# Altium schematic sheet MCU.SchDoc: MCU
size 420 x 297 mm; DrawnBy: Hung Vo; SheetNumber: 1; SheetTotal: 4; MasterProject: BTL TKHTN
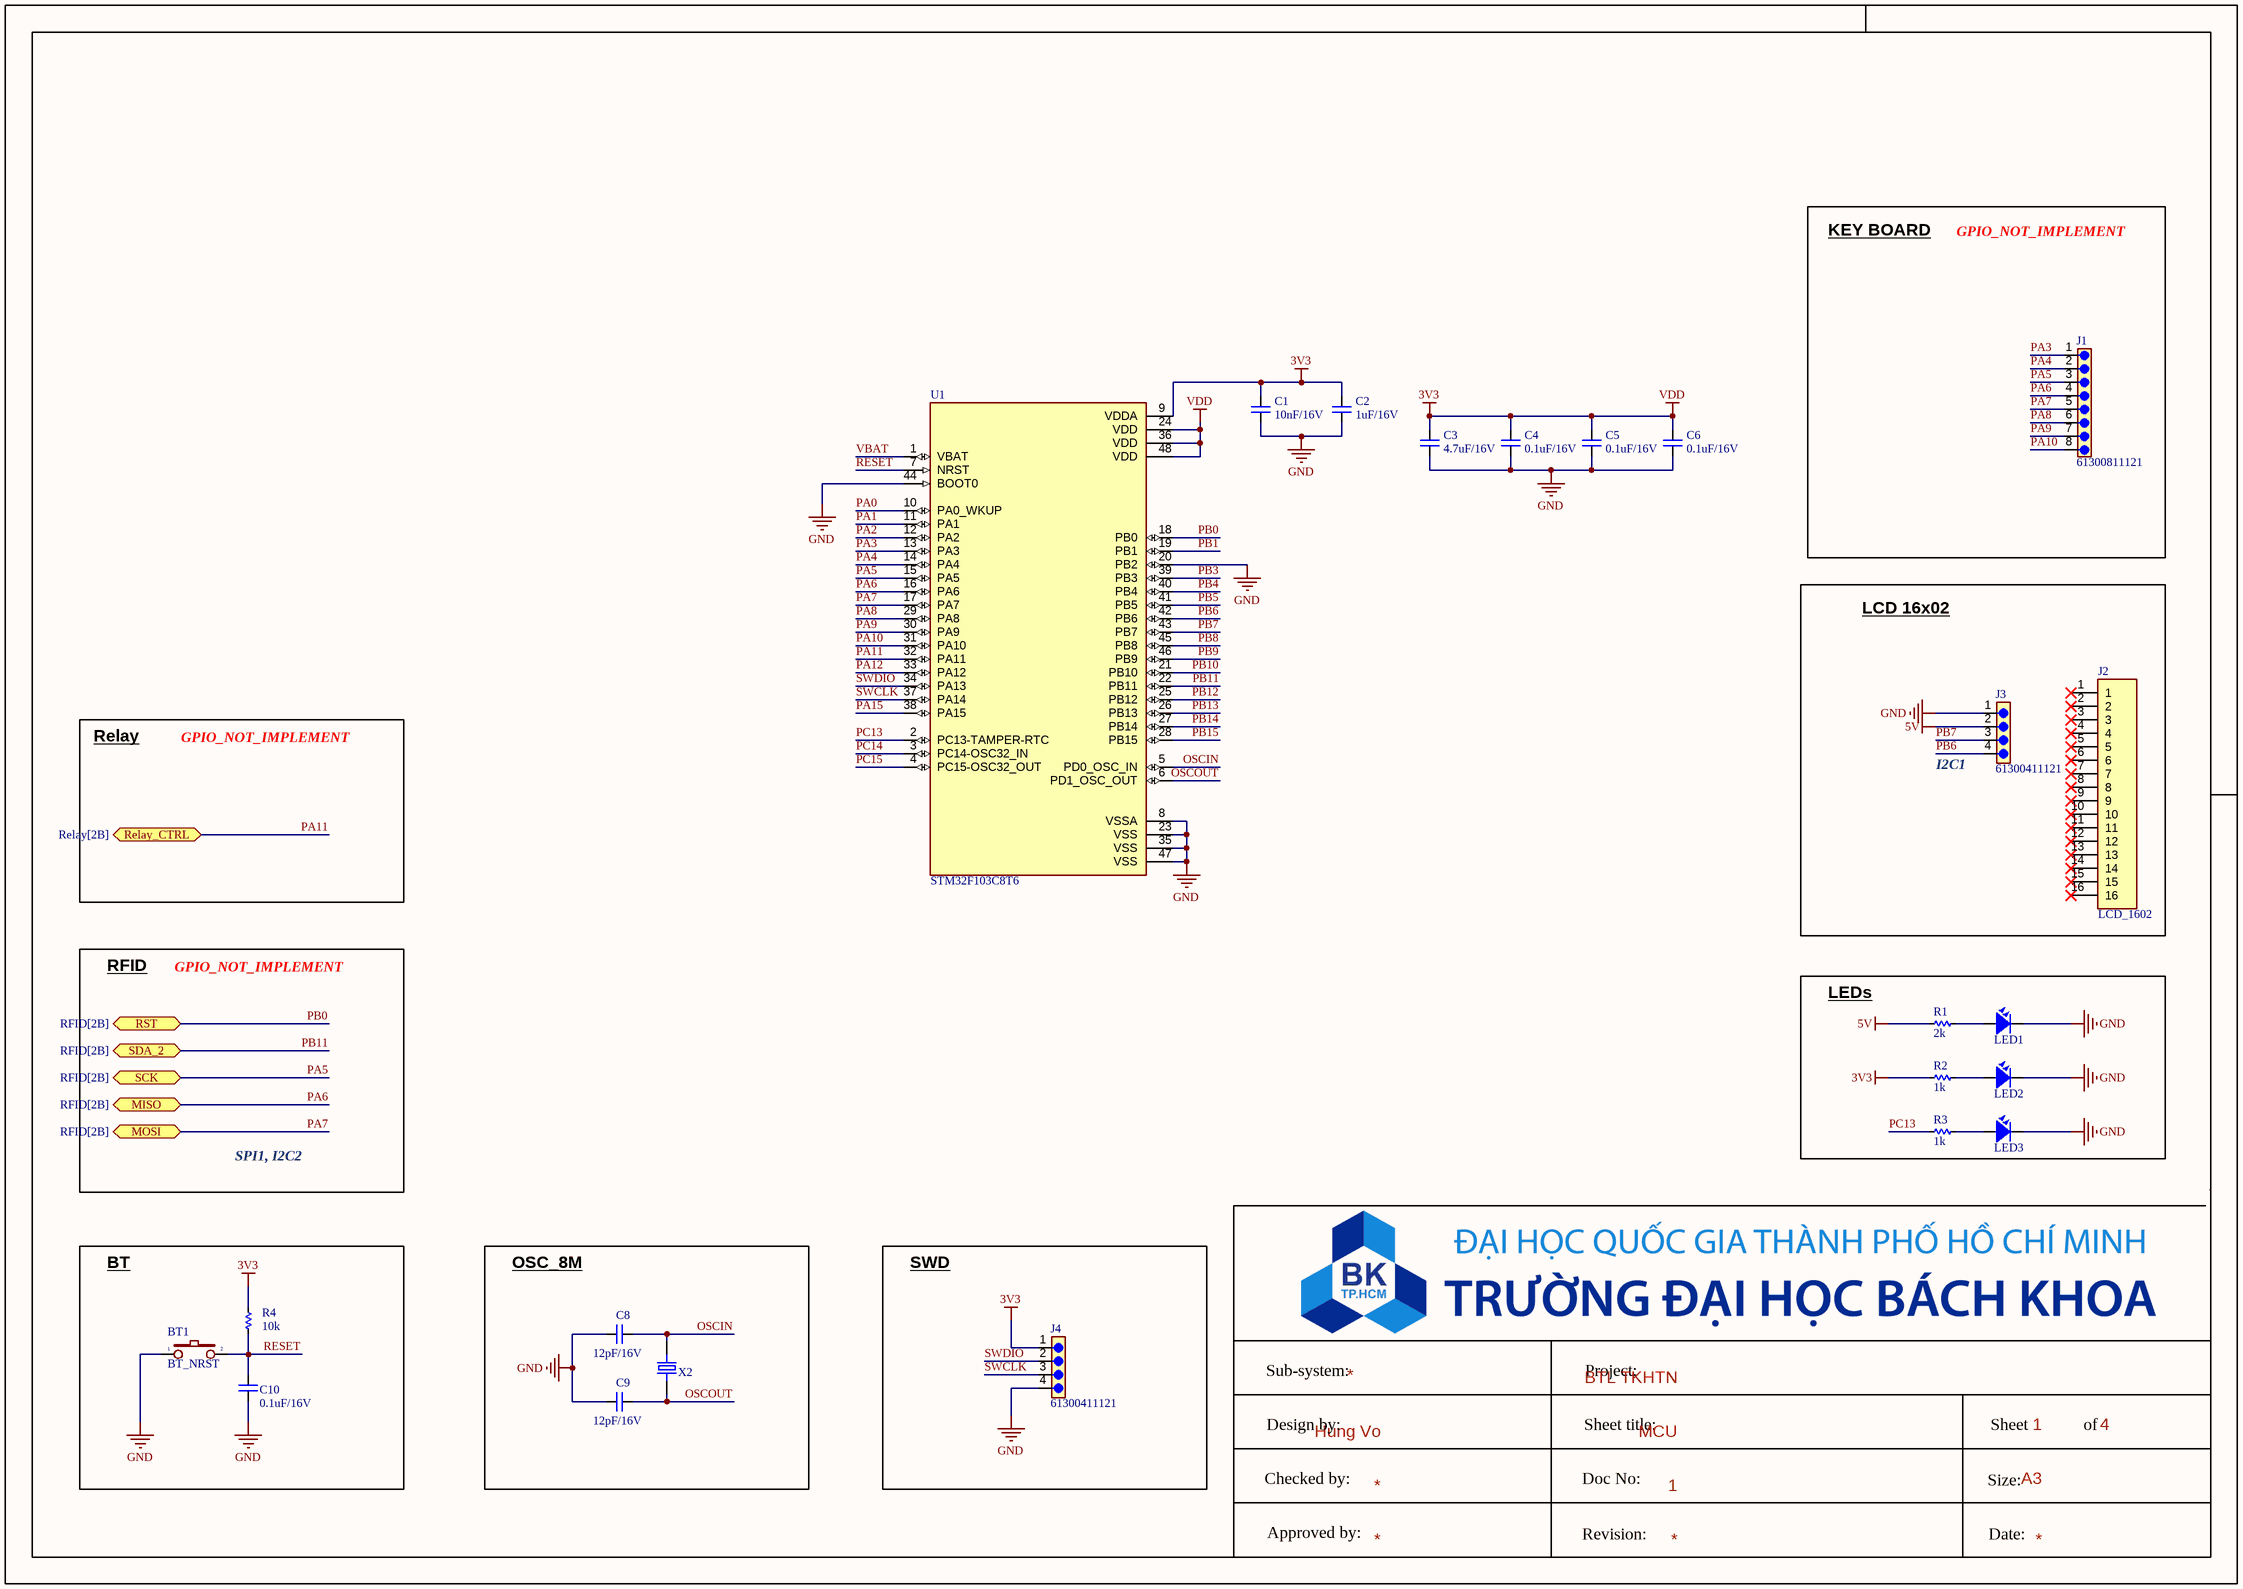
[diagram p0: MCU.SchDoc]

## Parts
BT1  BT_NRST  [SW2-SMD]
C1  10nF/16V  [CAP_C_1608X80]
C2  1uF/16V  [CAP_C_1608X80]
C3  4.7uF/16V  [CAP_C_1608X80]
C4  0.1uF/16V  [CAP_C_1608X80]
C5  0.1uF/16V  [CAP_C_1608X80]
C6  0.1uF/16V  [CAP_C_1608X80]
C8  12pF/16V  [CAP_C_1608X80]
C9  12pF/16V  [CAP_C_1608X80]
C10  0.1uF/16V  [CAP_C_1608X80]
J1  61300811121  [61300811121]
J2  LCD_1602  [LCD_1602]
J3  61300411121  [61300411121]
J4  61300411121  [61300411121]
LED1  LED  [LED-0603-RED]  (value not drawn)
LED2  LED  [LED-0603-RED]  (value not drawn)
LED3  LED  [LED-0603-RED]  (value not drawn)
R1  2k  [RES_C_1608X60]
R2  1k  [RES_C_1608X60]
R3  1k  [RES_C_1608X60]
R4  10k  [RES_C_1608X60]
U1  STM32F103C8T6  [QFP50P900X900X160-48N]
X2  ECS-080-18-5PX-JES-TR  [XTAL 8MHz]  (value not drawn)

## Blocks framed on the sheet
KEY BOARD: J1
LCD 16x02: J2 J3
LEDs: LED1-LED3 R1-R3
BT: BT1 C10 R4
OSC_8M: C8 C9 X2
SWD: J4

## Ports
MISO (bidir, see RFID[2B]), MOSI (bidir, see RFID[2B]), Relay_CTRL (bidir, see Relay[2B]), RST (bidir, see RFID[2B]), SCK (bidir, see RFID[2B]), SDA_2 (bidir, see RFID[2B])

## Nets
3V3: C1.2 C2.2 C3.2 C4.2 C5.2 C6.2 J4.1 R2.2 R4.2 U1.9(VDDA) U1.24(VDD) U1.36(VDD) U1.48(VDD)  [also labelled VDD]
5V: J3.2 R1.2
GND: BT1.1 C1.1 C2.1 C3.1 C4.1 C5.1 C6.1 C8.1 C9.1 C10.1 J3.1 J4.4 LED1.2 LED2.2 LED3.2 U1.8(VSSA) U1.20(PB2) U1.23(VSS) U1.35(VSS) U1.44(BOOT0) U1.47(VSS)
OSCIN: C8.2 U1.5(PD0_OSC_IN) X2.1
OSCOUT: C9.2 U1.6(PD1_OSC_OUT) X2.2
PA0: U1.10(PA0_WKUP)
PA1: U1.11(PA1)
PA2: U1.12(PA2)
PA3: J1.1 U1.13(PA3)
PA4: J1.2 U1.14(PA4)
PA5: J1.3 U1.15(PA5) ; port SCK
PA6: J1.4 U1.16(PA6) ; port MISO
PA7: J1.5 U1.17(PA7) ; port MOSI
PA8: J1.6 U1.29(PA8)
PA9: J1.7 U1.30(PA9)
PA10: J1.8 U1.31(PA10)
PA11: U1.32(PA11) ; port Relay_CTRL
PA12: U1.33(PA12)
PA15: U1.38(PA15)
PB0: U1.18(PB0) ; port RST
PB1: U1.19(PB1)
PB3: U1.39(PB3)
PB4: U1.40(PB4)
PB5: U1.41(PB5)
PB6: J3.4 U1.42(PB6)
PB7: J3.3 U1.43(PB7)
PB8: U1.45(PB8)
PB9: U1.46(PB9)
PB10: U1.21(PB10)
PB11: U1.22(PB11) ; port SDA_2
PB12: U1.25(PB12)
PB13: U1.26(PB13)
PB14: U1.27(PB14)
PB15: U1.28(PB15)
PC13: R3.2 U1.2(PC13-TAMPER-RTC)
PC14: U1.3(PC14-OSC32_IN)
PC15: U1.4(PC15-OSC32_OUT)
RESET: BT1.2 C10.2 R4.1 U1.7(NRST)
SWCLK: J4.3 U1.37(PA14)
SWDIO: J4.2 U1.34(PA13)
VBAT: U1.1(VBAT)
NetLED1_1: LED1.1 R1.1
NetLED2_1: LED2.1 R2.1
NetLED3_1: LED3.1 R3.1

Not connected (* = marked no-connect by the designer): J2 1* 2* 3* 4* 5* 6* 7* 8* 9* 10* 11* 12* 13* 14* 15* 16*

## Notes on the sheet
- GPIO_NOT_IMPLEMENT
- Relay
- (near J3) I2C1
- RFID
- SPI1, I2C2
- Sub-system:
- Project:
- Design by:
- Sheet title:
- Sheet
- of
- Checked by:
- Approved by:
- Doc No:
- Revision:
- Size:
- Date:
- A3

## Library data of the parts
BT1 = BT2: Switch button 2 pin; Value: SW chip 2 pin
C1-C6 C8-C10 = CAP_SMD: CAP_Chip; Value: 33pF
J1 = 61300811121: 8 pins, 1 row, straight, gold plating; MF: Wurth Electronics; SnapEDA_Link: https://www.snapeda.com/parts/61300811121/Wurth+Electronics/view-part/?ref=snap; Package: None; Value: *; MP: 61300811121; Check_prices: https://www.snapeda.com/parts/61300811121/Wurth+Electronics/view-part/?ref=eda
J3 J4 = 61300411121: CONN HEADER VERT 4POS 2.54MM; MF: WÃ¼rth Elektronik; SnapEDA_Link: https://www.snapeda.com/parts/61300411121/W%25C3%25BCrth+Elektronik+Midcom/view-part/?ref=snap; Package: None; Value: *; MP: 61300411121; Check_prices: https://www.snapeda.com/parts/61300411121/W%25C3%25BCrth+Elektronik+Midcom/view-part/?ref=eda
LED1-LED3 = LED SMD: Value: LED 3 - 5 ly 2 Colour
R1-R4 = RES_SMD: RES
U1 = STM32F103C8T6: ARM® Cortex®-M3 STM32F1 Microcontroller IC 32-Bit 72MHz 64KB (64K x 8) FLASH 48-LQFP (7x7); MF: STMicroelectronics; SnapEDA_Link: https://www.snapeda.com/parts/STM32F103C8T6/STMicroelectronics/view-part/?ref=snap; Package: LQFP-48 STMicroelectronics; Value: *; MP: STM32F103C8T6; Check_prices: https://www.snapeda.com/parts/STM32F103C8T6/STMicroelectronics/view-part/?ref=eda
X2 = ECS-080-18-5PX-JES-TR: 8 MHz Â±20ppm Crystal 18pF 60 Ohms HC-49/US; MF: ECS Inc.; SnapEDA_Link: https://www.snapeda.com/parts/ECS-080-18-5PX-JES-TR/ECS/view-part/?ref=snap; Package: CSM-7X-3L-5G3X-2 ECS; Value: *; MP: ECS-080-18-5PX-JES-TR; Check_prices: https://www.snapeda.com/parts/ECS-080-18-5PX-JES-TR/ECS/view-part/?ref=eda